# Altium project PCB Muestreo.PrjPcb
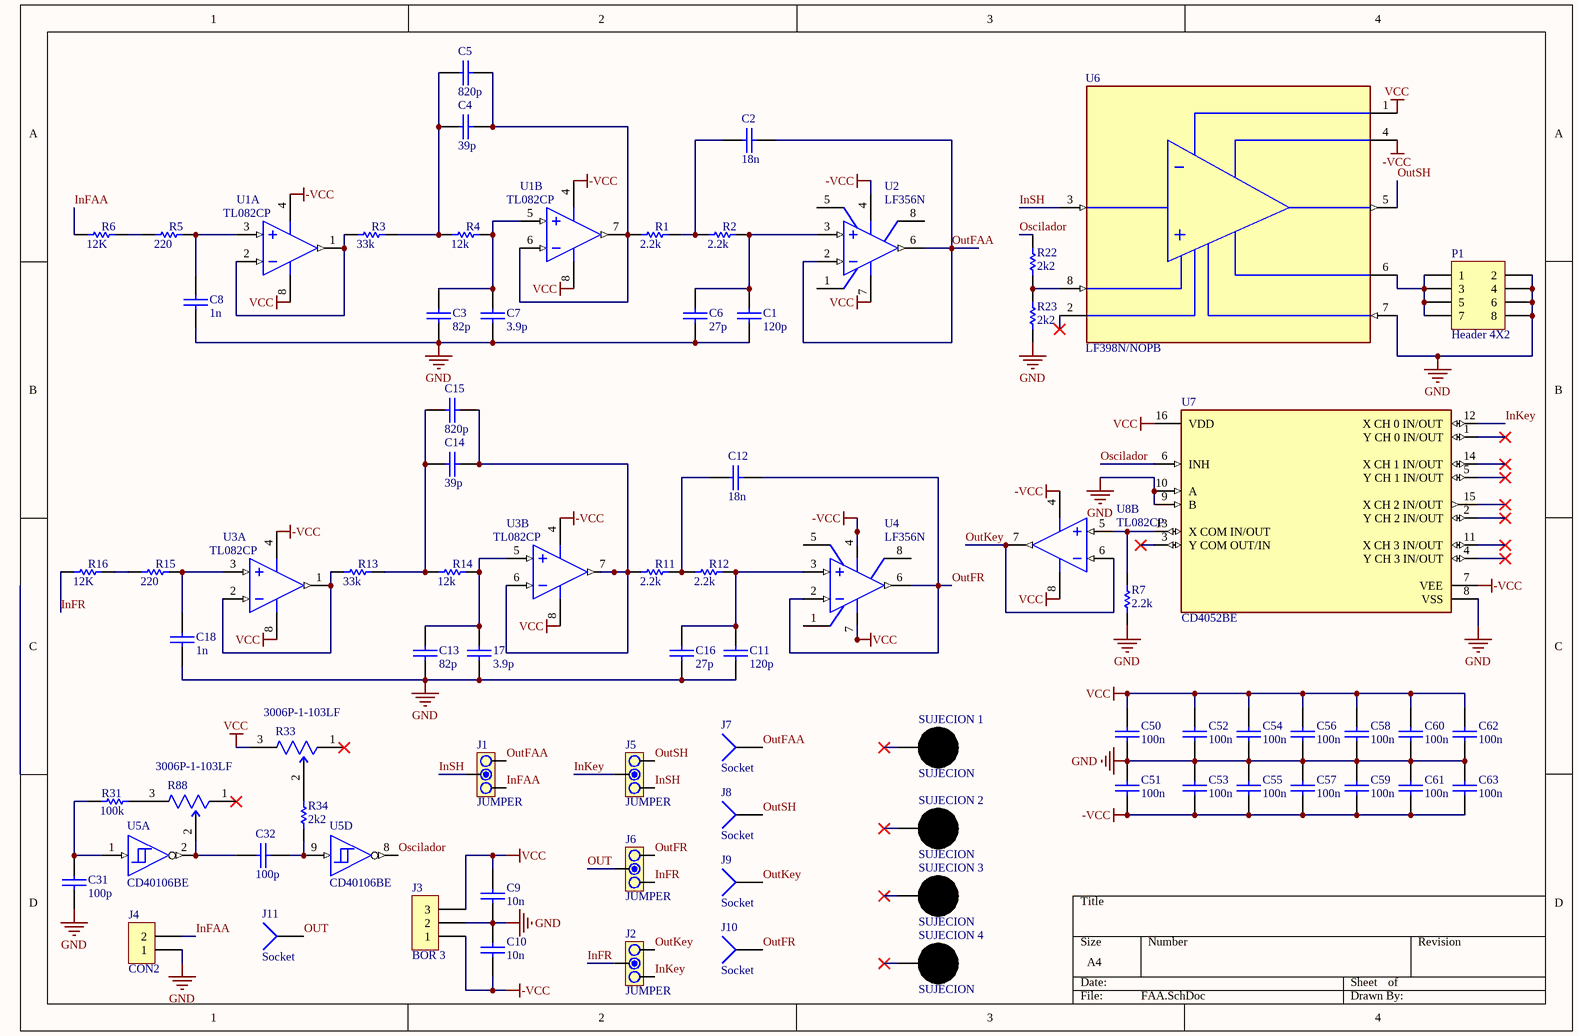
[diagram p0: FAA.SchDoc]
1 sheet, 77 parts. Net scope: global (net labels, ports and power ports of the same name join across sheets).
Board file: PCB1.PcbDoc

## Sheet FAA.SchDoc
size A4; SheetNumber: 1; SheetTotal: 1

### Parts
17  3.9p  [CAP200]
C1  120p  [CAP200]
C2  18n  [CAP200]
C3  82p  [CAP200]
C4  39p  [CAP200]
C5  820p  [CAP200]
C6  27p  [CAP200]
C7  3.9p  [CAP200]
C8  1n  [CAP200]
C9  10n  [CAP100]
C10  10n  [CAP100]
C11  120p  [CAP200]
C12  18n  [CAP200]
C13  82p  [CAP200]
C14  39p  [CAP200]
C15  820p  [CAP200]
C16  27p  [CAP200]
C18  1n  [CAP200]
C31  100p  [CAP200]
C32  100p  [CAP200]
C50  100n  [CAP100]
C51  100n  [CAP100]
C52  100n  [CAP100]
C53  100n  [CAP100]
C54  100n  [CAP100]
C55  100n  [CAP100]
C56  100n  [CAP100]
C57  100n  [CAP100]
C58  100n  [CAP100]
C59  100n  [CAP100]
C60  100n  [CAP100]
C61  100n  [CAP100]
C62  100n  [CAP100]
C63  100n  [CAP100]
J1  JUMPER  [JUMPER3]
J2  JUMPER  [JUMPER3]
J3  BOR 3  [BORNERA3]
J4  CON2  [SIP2]
J5  JUMPER  [JUMPER3]
J6  JUMPER  [JUMPER3]
J7  Socket  [PIN1]
J8  Socket  [PIN1]
J9  Socket  [PIN1]
J10  Socket  [PIN1]
J11  Socket  [PIN1]
P1  Header 4X2  [HDR2X4]
R1  2.2k  [RES400]
R2  2.2k  [RES400]
R3  33k  [RES400]
R4  12k  [RES400]
R5  220  [RES400]
R6  12K  [RES400]
R7  2.2k  [RES400]
R11  2.2k  [RES400]
R12  2.2k  [RES400]
R13  33k  [RES400]
R14  12k  [RES400]
R15  220  [RES400]
R16  12K  [RES400]
R22  2k2  [RES400]
R23  2k2  [RES400]
R31  100k  [RES400]
R33  3006P-1-103LF  [FP-3006P-MFG]
R34  2k2  [RES400]
R88  3006P-1-103LF  [FP-3006P-MFG]
SUJECION_1  SUJECION  [SUJECION (5.00MM - 3.50MM)]
SUJECION_2  SUJECION  [SUJECION (5.00MM - 3.50MM)]
SUJECION_3  SUJECION  [SUJECION (5.00MM - 3.50MM)]
SUJECION_4  SUJECION  [SUJECION (5.00MM - 3.50MM)]
U1  TL082CP  [P0008A]  (parts A,B of 2)
U2  LF356N  [P0008A]
U3  TL082CP  [P0008A]  (parts A,B of 2)
U4  LF356N  [P0008A]
U5  CD40106BE  [N0014A]  (parts A,D of 7)
U6  LF398N/NOPB  [FP-P0008A-MFG]
U7  CD4052BE  [FP-N0016A-MFG]
U8  TL082CP  [P0008A]  (part B of 2)

### Nets
-VCC: C10.2 C51.2 C53.2 C55.2 C57.2 C59.2 C61.2 C63.2 J3.1 U1.4(VCC-) U2.4(V-) U3.4(VCC-) U4.4(V-) U6.4(V-) U7.7(VEE) U8.4(VCC-)
GND: 17.2 C1.2 C3.2 C6.2 C7.2 C8.2 C9.2 C10.1 C11.2 C13.2 C16.2 C18.2 C31.2 C50.2 C51.1 C52.2 C53.1 C54.2 C55.1 C56.2 C57.1 C58.2 C59.1 C60.2 C61.1 C62.2 C63.1 J3.2 J4.1 P1.2 P1.4 P1.6 P1.8 R7.1 R23.2 U6.7(LOGIC_REFERENCE) U7.8(VSS) U7.9(B) U7.10(A)
VCC: C9.1 C50.1 C52.1 C54.1 C56.1 C58.1 C60.1 C62.1 J3.3 R33.3(CW) U1.8(VCC+) U2.7(V+) U3.8(VCC+) U4.7(V+) U6.1(V+) U7.16(VDD) U8.8(VCC+)
InFAA: J1.3 J4.2 R6.1
InFR: J2.2 J6.3 R16.1
InKey: J2.3 J5.2 U7.12(X_CH_0_IN/OUT)
InSH: J1.2 J5.3 U6.3(INPUT)
Oscilador: R22.1 U5.8(J=~{D}) U7.6(INH)
OUT: J6.2 J11.1
OutFAA: C2.2 J1.1 J7.1 U2.2(IN-) U2.6(OUT)
OutFR: C12.2 J6.1 J10.1 U4.2(IN-) U4.6(OUT)
OutKey: J2.1 J9.1 U8.6(IN2-) U8.7(OUT2)
OutSH: J5.1 J8.1 U6.5(OUTPUT)
Net17_1: 17.1 C13.1 R14.2 U3.5(IN2+)
NetC1_1: C1.1 C6.1 R2.2 U2.3(IN+)
NetC2_1: C2.1 R1.2 R2.1
NetC3_1: C3.1 C7.1 R4.2 U1.5(IN2+)
NetC4_1: C4.1 C5.1 R3.2 R4.1
NetC4_2: C4.2 C5.2 R1.1 U1.6(IN2-) U1.7(OUT2)
NetC8_1: C8.1 R5.2 U1.3(IN1+)
NetC11_1: C11.1 C16.1 R12.2 U4.3(IN+)
NetC12_1: C12.1 R11.2 R12.1
NetC14_1: C14.1 C15.1 R13.2 R14.1
NetC14_2: C14.2 C15.2 R11.1 U3.6(IN2-) U3.7(OUT2)
NetC18_1: C18.1 R15.2 U3.3(IN1+)
NetC31_1: C31.1 R31.1 U5.1(A)
NetC32_1: C32.1 R88.2(WIPER) U5.2(G=~{A})
NetC32_2: C32.2 R34.1 U5.9(D)
NetP1_1: P1.1 P1.3 P1.5 P1.7 U6.6(Ch)
NetR3_1: R3.1 U1.1(OUT1) U1.2(IN1-)
NetR5_1: R5.1 R6.2
NetR7_2: R7.2 U7.13(X_COM_IN/OUT) U8.5(IN2+)
NetR13_1: R13.1 U3.1(OUT1) U3.2(IN1-)
NetR15_1: R15.1 R16.2
NetR22_2: R22.2 R23.1 U6.8(LOGIC)
NetR31_2: R31.2 R88.3(CW)
NetR33_2: R33.2(WIPER) R34.2

Not connected (* = marked no-connect by the designer): R33 1(CCW)*; R88 1(CCW)*; SUJECION_1 1*; SUJECION_2 1*; SUJECION_3 1*; SUJECION_4 1*; U2 1(BAL) 5(BAL) 8(NC); U4 1(BAL) 5(BAL) 8(NC); U6 2(OFFSET_ADJUST)*; U7 1(Y_CH_0_IN/OUT)* 2(Y_CH_2_IN/OUT)* 3(Y_COM_OUT/IN)* 4(Y_CH_3_IN/OUT)* 5(Y_CH_1_IN/OUT)* 11(X_CH_3_IN/OUT)* 14(X_CH_1_IN/OUT)* 15(X_CH_2_IN/OUT)*

### Library data of the parts
17 C1-C16 C18 C31 C32 C50-C63 = CAP
J1 J2 J5 J6 = JUMPER3
J3 = BORNERA 3
P1 = Header 4X2: Header, 4-Pin, Dual row; LatestRevisionDate: 17-Jul-2002; LatestRevisionNote: Re-released for DXP Platform.; Publisher: Altium Limited
R1-R7 R11-R16 R22 R23 R31 R34 = RES
R33 R88 = CMP-07234-000047-1: TRIMMER 10KOHM 0.75W PC PIN SIDE; Manufacturer Series: 3006; Pin Diameter: 0.6mm; Resistance Tolerance: 10%; Actuator Type: SCREW; Number of Turns: 15; Insulation Resistance: 1GR; Pitch: 2.5mm; Power Rating: 750mW; Resistance Law: Linear; Temperature Coefficient: 100ppm/°C; Resistance: 10kR; Number of Terminals/Pins: 3; Actuator Orientation: Horizontal; Package Quantity: 100; Depth: 4.83mm; Width: 4.83mm; Termination: Pin; Packaging: Rail/Tube; Height: 6.35mm; Terminal Finish: Tin; Color: Blue; Thickness: 5.59mm; Lead Free: Lead Free; Min Operating Temperature: -55°C; Type: Potentiometer; Radiation Hardening: No; Weight: 0.04oz; Mount: Panel; RoHS Compliant: Yes; Length: 20.57mm; Tolerance: 10%; Number of Pins: 3; Taper: Linear; Military Standard: Not; Resistor Type: Cermet; Max Operating Temperature: 125°C; REACH SVHC: No SVHC; Technology: CERMET; Max Power Dissipation: 750mW; Series: 3006
U1 U3 U8 = CMP-0055-00158-5: JFET-Input Operational Amplifier, 7 to 36 V, 0 to 70 degC, 8-pin DIP (P8), Pb-Free (RoHS); Manufacturer: Texas Instruments; Total Supply Voltage(Max)(+5V is 5, +/-5V is 10): 36; Rating: Catalog; Number of Channels: 2; Slew Rate(Typ)(V/us): 13; CMRR(Min)(dB): 70; Sub Family: General Purpose Amplifier, High Supply Voltage Amplifier (>=30V); Offset Drift(Typ)(uV/C): 18; Total Supply Voltage(Min)(+5V is 5, +/-5V is 10): 7; IIB(Max)(pA): 400; GBW(Typ)(MHz): 3; Iq per channel(Max)(mA): 2.8; Vio (25C)(Max)(mV): 15; PackageDescription: 8-Pin Plastic In-Line, Body 9.59 x 6.35 mm, Pitch 2.54 mm; ComponentLink2URL: http://www.ti.com/lit/ds/symlink/tl082.pdf; Mounting Technology: Through Hole; Code_JEDEC: MS-001; ComponentLink1Description: Manufacturer URL; ComponentLink3Description: Package Specification; PartNumber: TL082CP; PackageVersion: 4040082/E, 04/2010; Eco-Plan: Pb-Free (RoHS); ComponentLink1URL: http://www.ti.com/; PackageReference: P0008A; ComponentLink3URL: http://www.ti.com/litv/pdf/mpdi001b; DatasheetVersion: SLOS081G; ComponentLink2Description: Datasheet; Vn at 1kHz(Typ)(nV/rtHz): 18
U2 U4 = CMP-0055-00204-3: JFET Input Operational Amplifier, 8-pin MDIP; Manufacturer: Texas Instruments; PowerWise: N; CompType: Amplifiers; PackageTopMarking: NSUZXYTTE#*LF*356N; Package Reference: P0008A; ComponentLink1URL: http://www.ti.com/general/docs/lit/getliterature.tsp?genericPartNumber=LF356&fileType=pdf; Code_JEDEC: MS-001-BA; PinCount: 8; ComponentLink1Description: Datasheet URL; PackageDescription: MDIP, .365 x .250 x .130in, 8 Lead, .100in Pitch; RoHS: N
U5 = CMP-1615-00909-3: CMOS Hex Schmitt Triggers, N0014A, TUBE; Manufacturer: Texas Instruments; F @ Nom Voltage(Max)(Mhz): 12; Rating: Catalog; Output Drive (IOL/IOH)(Max)(mA): -1/1; Voltage(Nom)(V): 5; VCC(Min)(V): 3; Bits(#): 6; Technology Family: CD4000; ICC @ Nom Voltage(Max)(mA): 0.03; Schmitt Trigger: Yes; tpd @ Nom Voltage(Max)(ns): 280; VCC(Max)(V): 18; DatasheetVersion: SCHS097D; Code_JEDEC: MS-001; Input Type: CMOS; Output Type: CMOS; Operating Temperature Range(C): -55 to 125; PackageReference: N0014A; Generic Part Number: CD40106B
U6 = CMP-04895-000240-1: IC OPAMP SAMPL/HOLD 1 CIRC 8DIP; Dual Supply Voltage: 15V; Gain Bandwidth Product: 1MHz; Number of Channels: 1; Min Supply Voltage: 5V; Max Supply Voltage: 18V; Input Offset Voltage (Vos): 2mV; Input Bias Current: 10nA; Nominal Supply Current: 4.5mA; Width: 6.35mm; Radiation Hardening: No; Lead Free: Lead Free; Contact Plating: Tin; RoHS Compliant: Yes; Number of Pins: 8; Packaging: Rail/Tube; Bandwidth: 1MHz; Weight: 0.032805oz; Number of Circuits: 1; Mount: Through Hole; Number of Amplifiers: 1; Package Quantity: 40; Operating Supply Voltage: 15V; Min Dual Supply Voltage: 5V; Case/Package: PDIP; Min Operating Temperature: 0°C; Length: 9.27mm; Series: LF398-N; Max Dual Supply Voltage: 18V; Supply Current: 4.5mA; Max Operating Temperature: 70°C; Height: 3.3mm; REACH SVHC: No SVHC
U7 = CMP-1575-00066-5: IC MUX/DEMUX DUAL 4X1 16DIP; Bandwidth: 25MHz; Turn-Off Delay Time: 450ns; Number of Channels: 2; Min Supply Voltage: 3V; Number of Inputs: 8; Min Dual Supply Voltage: 2.5V; Number of Terminals/Pins: 16; Supply Type: Single; Max Dual Supply Voltage: 9V; Operating Supply Current: 80nA; Number of Bits: 4; Max Supply Voltage: 20V; Turn-On Delay Time: 720ns; Polarity: Non-Inverting; Propagation Delay: 60ns; Operating Supply Voltage: 18V; Logic Function: Multiplexer; Throw Configuration: SP4T; On-State Resistance: 240R; Number of Circuits: 2; Weight: 0.03357oz; REACH SVHC: No SVHC; Mount: Through Hole; Packaging: Rail/Tube; Width: 7.62mm; RoHS Compliant: Yes; Radiation Hardening: No; Lead Free: Lead Free; Nominal Supply Current: 80nA; Number of Outputs: 2; Package Quantity: 25; Quiescent Current: 80nA; Min Operating Temperature: -55°C; Number of Pins: 16; Contact Plating: Gold; Case/Package: PDIP; Max Input Voltage: 20V; Max Operating Temperature: 125°C
J7-J11 = Socket: LatestRevisionDate: 17-Jul-2002; LatestRevisionNote: Re-released for DXP Platform.; Publisher: Altium Limited